# EAGLE design CAN TOF (EAGLE 9.2.2)

## Sheet 1 of 2
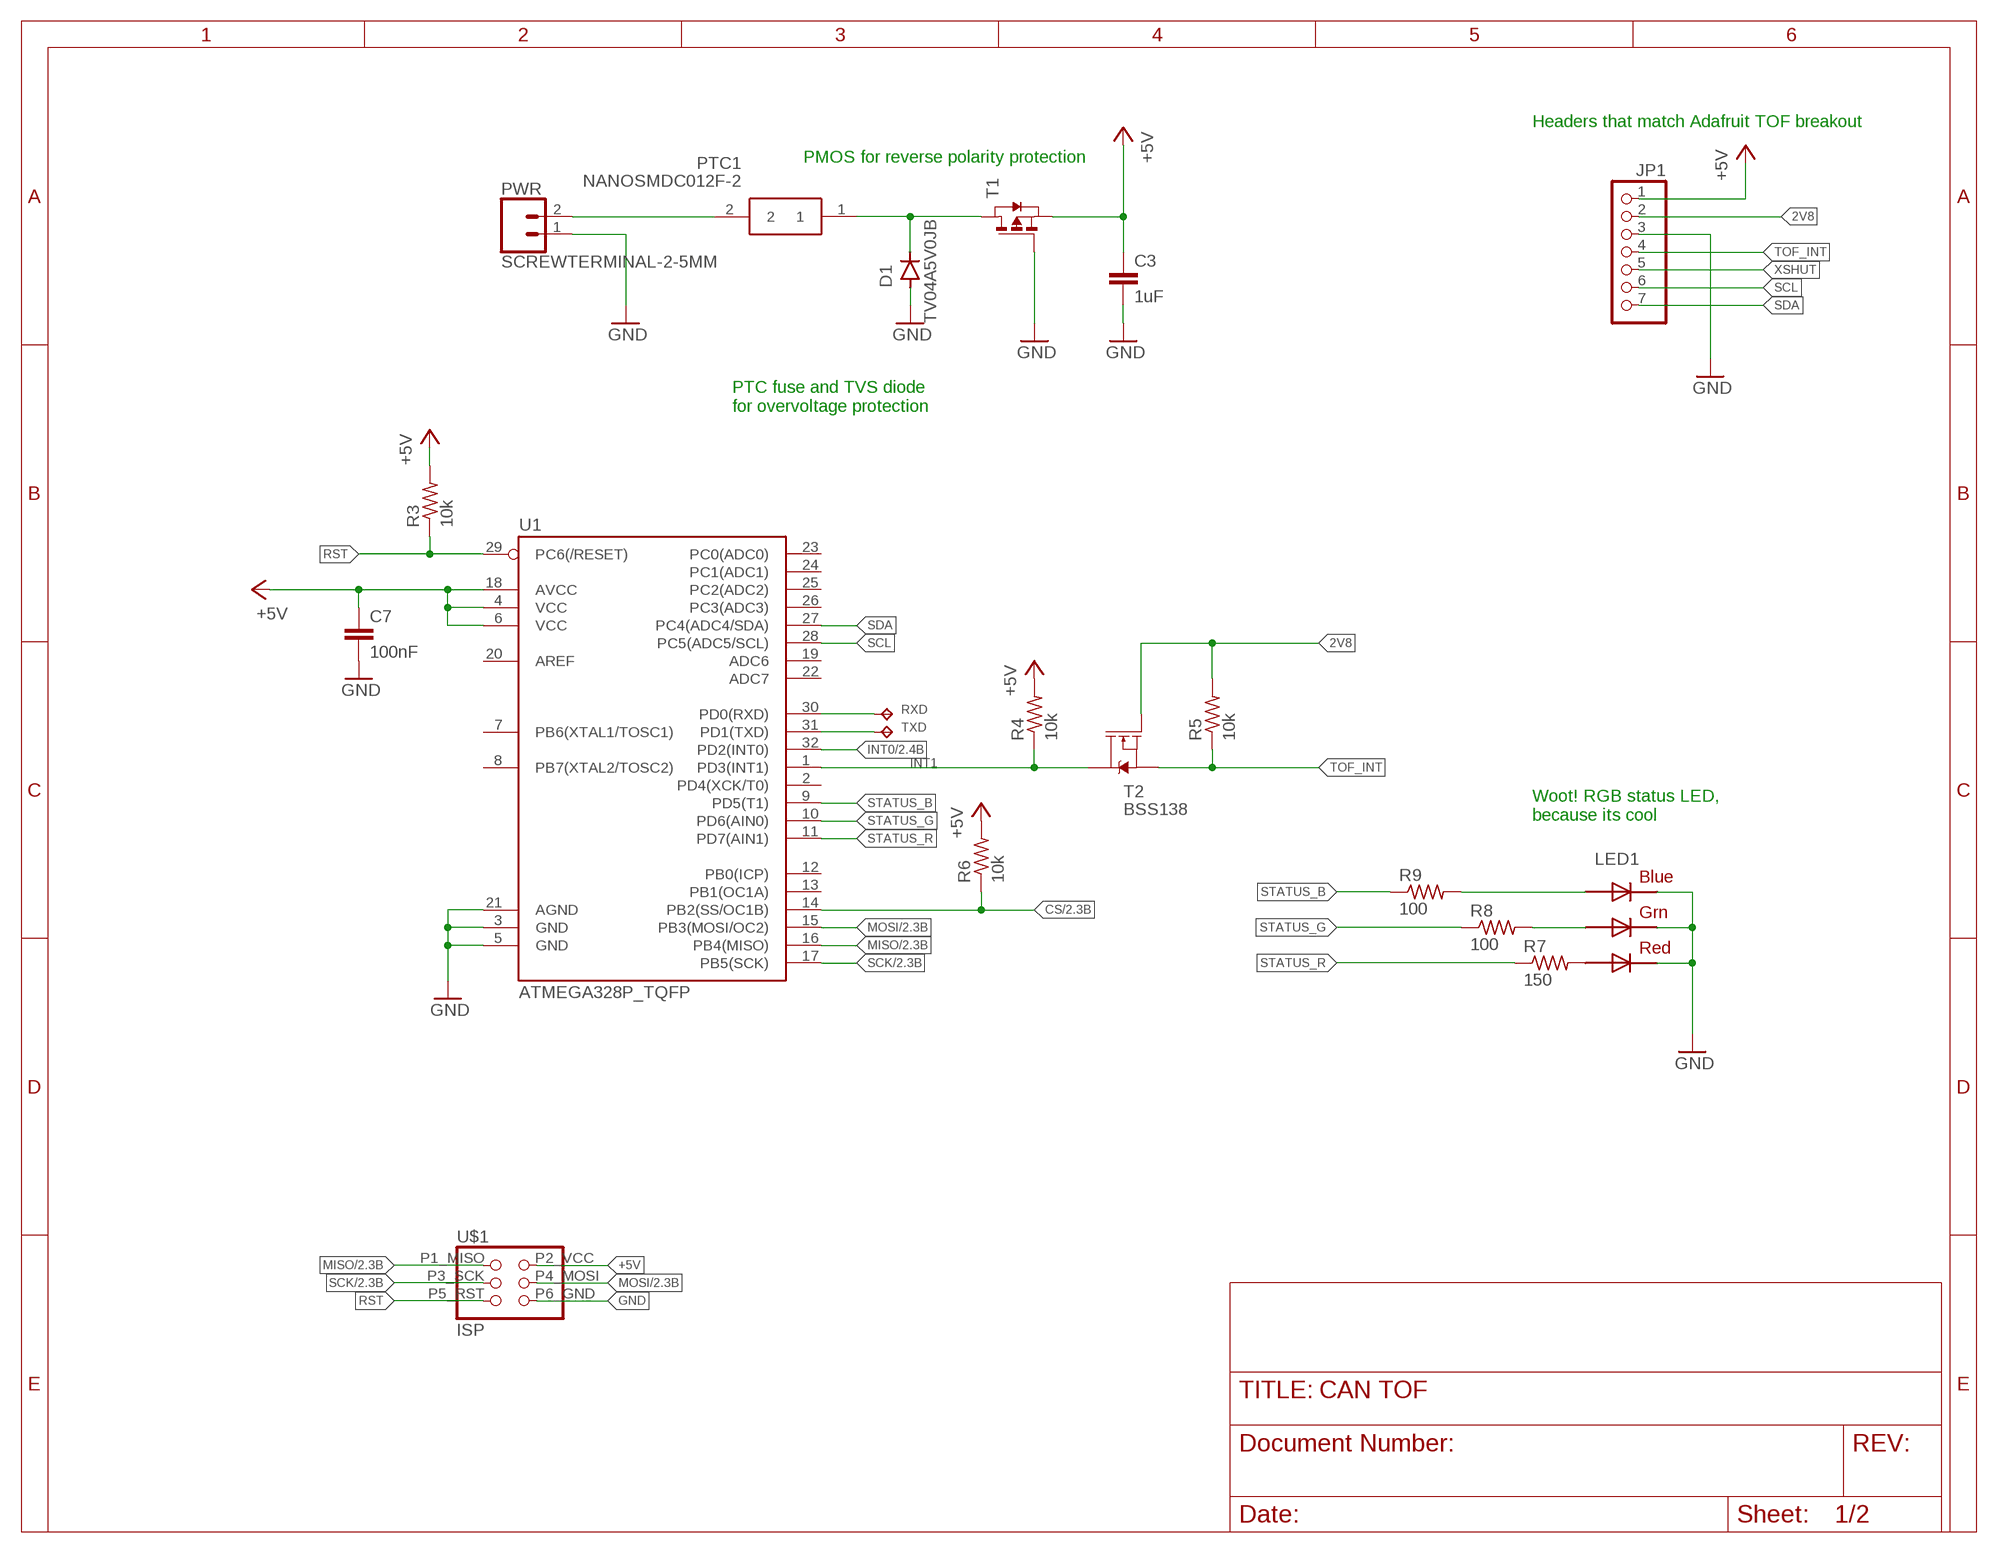
[diagram p0: schematic, sheet 1]

### Parts
C3  1uF  C-EUC0805  [C0805]
C7  100nF  C-EUC0402  [C0402]
D1  TV04A5V0JB  GF1  [SMA-DO214AC]
JP1  PINHD-1X7  [1X07]
LED1  RGBLED5050  [RGBLED5050]
PTC1  NANOSMDC012F-2  NANOSMDC010F-2  [FUSC3216X100N]
PWR  SCREWTERMINAL-2-5MM  [SCREWTERMINAL-5MM-2]
R3  10k  R-US_R0805  [R0805]
R4  10k  R-US_R0805  [R0805]
R5  10k  R-US_R0805  [R0805]
R6  10k  R-US_R0805  [R0805]
R7  150  R-US_R0805  [R0805]
R8  100  R-US_R0805  [R0805]
R9  100  R-US_R0805  [R0805]
RXD  TPB1,27  [B1,27]
T1  PMOSSOT23  [SOT-23]
T2  BSS138  MOSFET-NCH-BSS138  [SOT23-3]
TXD  TPB1,27  [B1,27]
U1  ATMEGA328P_TQFP  [TQFP32-08]
U$1  ISP  [ISP]

### Nets
2V8: JP1.2 R5.2 T2.1(G)
+5V: C3.1 C7.1 JP1.1 R3.2 R4.2 R6.2 T1.2(S) U1.4(VCC) U1.6(VCC) U1.18(AVCC) U$1.P2_VCC(VCC) ; also sheet 2
CS: R6.1 U1.14(PB2(SS/OC1B)) ; also sheet 2
GND: C3.2 C7.2 D1.A JP1.3 LED1.4(BLUE_C) LED1.5(RED_C) LED1.6(GREEN_C) PWR.1 T1.3(G) U1.3(GND) U1.5(GND) U1.21(AGND) U$1.P6_GND(GND) ; also sheet 2
INT0: U1.32(PD2(INT0)) ; also sheet 2
INT1: R4.1 T2.3(D) U1.1(PD3(INT1))
MISO: U1.16(PB4(MISO)) U$1.P1_MISO(MISO) ; also sheet 2
MOSI: U1.15(PB3(MOSI/OC2)) U$1.P4_MOSI(MOSI) ; also sheet 2
N$5: RXD.TP U1.30(PD0(RXD))
N$6: TXD.TP U1.31(PD1(TXD))
N$7: PTC1.2 PWR.2
N$8: D1.K(C) PTC1.1 T1.1(D)
N$9: LED1.2(RED_A) R7.2
N$10: LED1.1(GREEN_A) R8.2
N$11: LED1.3(BLUE_A) R9.2
RST: R3.1 U1.29(PC6(/RESET)) U$1.P5_RST(RST)
SCK: U1.17(PB5(SCK)) U$1.P3_SCK(SCK) ; also sheet 2
SCL: JP1.6 U1.28(PC5(ADC5/SCL))
SDA: JP1.7 U1.27(PC4(ADC4/SDA))
STATUS_B: R9.1 U1.9(PD5(T1))
STATUS_G: R8.1 U1.10(PD6(AIN0))
STATUS_R: R7.1 U1.11(PD7(AIN1))
TOF_INT: JP1.4 R5.1 T2.2(S)
XSHUT: JP1.5
Unconnected: U1.2(PD4(XCK/T0)) U1.7(PB6(XTAL1/TOSC1)) U1.8(PB7(XTAL2/TOSC2)) U1.12(PB0(ICP)) U1.13(PB1(OC1A)) U1.19(ADC6) U1.20(AREF) U1.22(ADC7) U1.23(PC0(ADC0)) U1.24(PC1(ADC1)) U1.25(PC2(ADC2)) U1.26(PC3(ADC3))

### Notes on the sheet
- Headers that match Adafruit TOF breakout
- PMOS for reverse polarity protection
- PTC fuse and TVS diode
  for overvoltage protection
- Woot! RGB status LED,
  because its cool

## Sheet 2 of 2
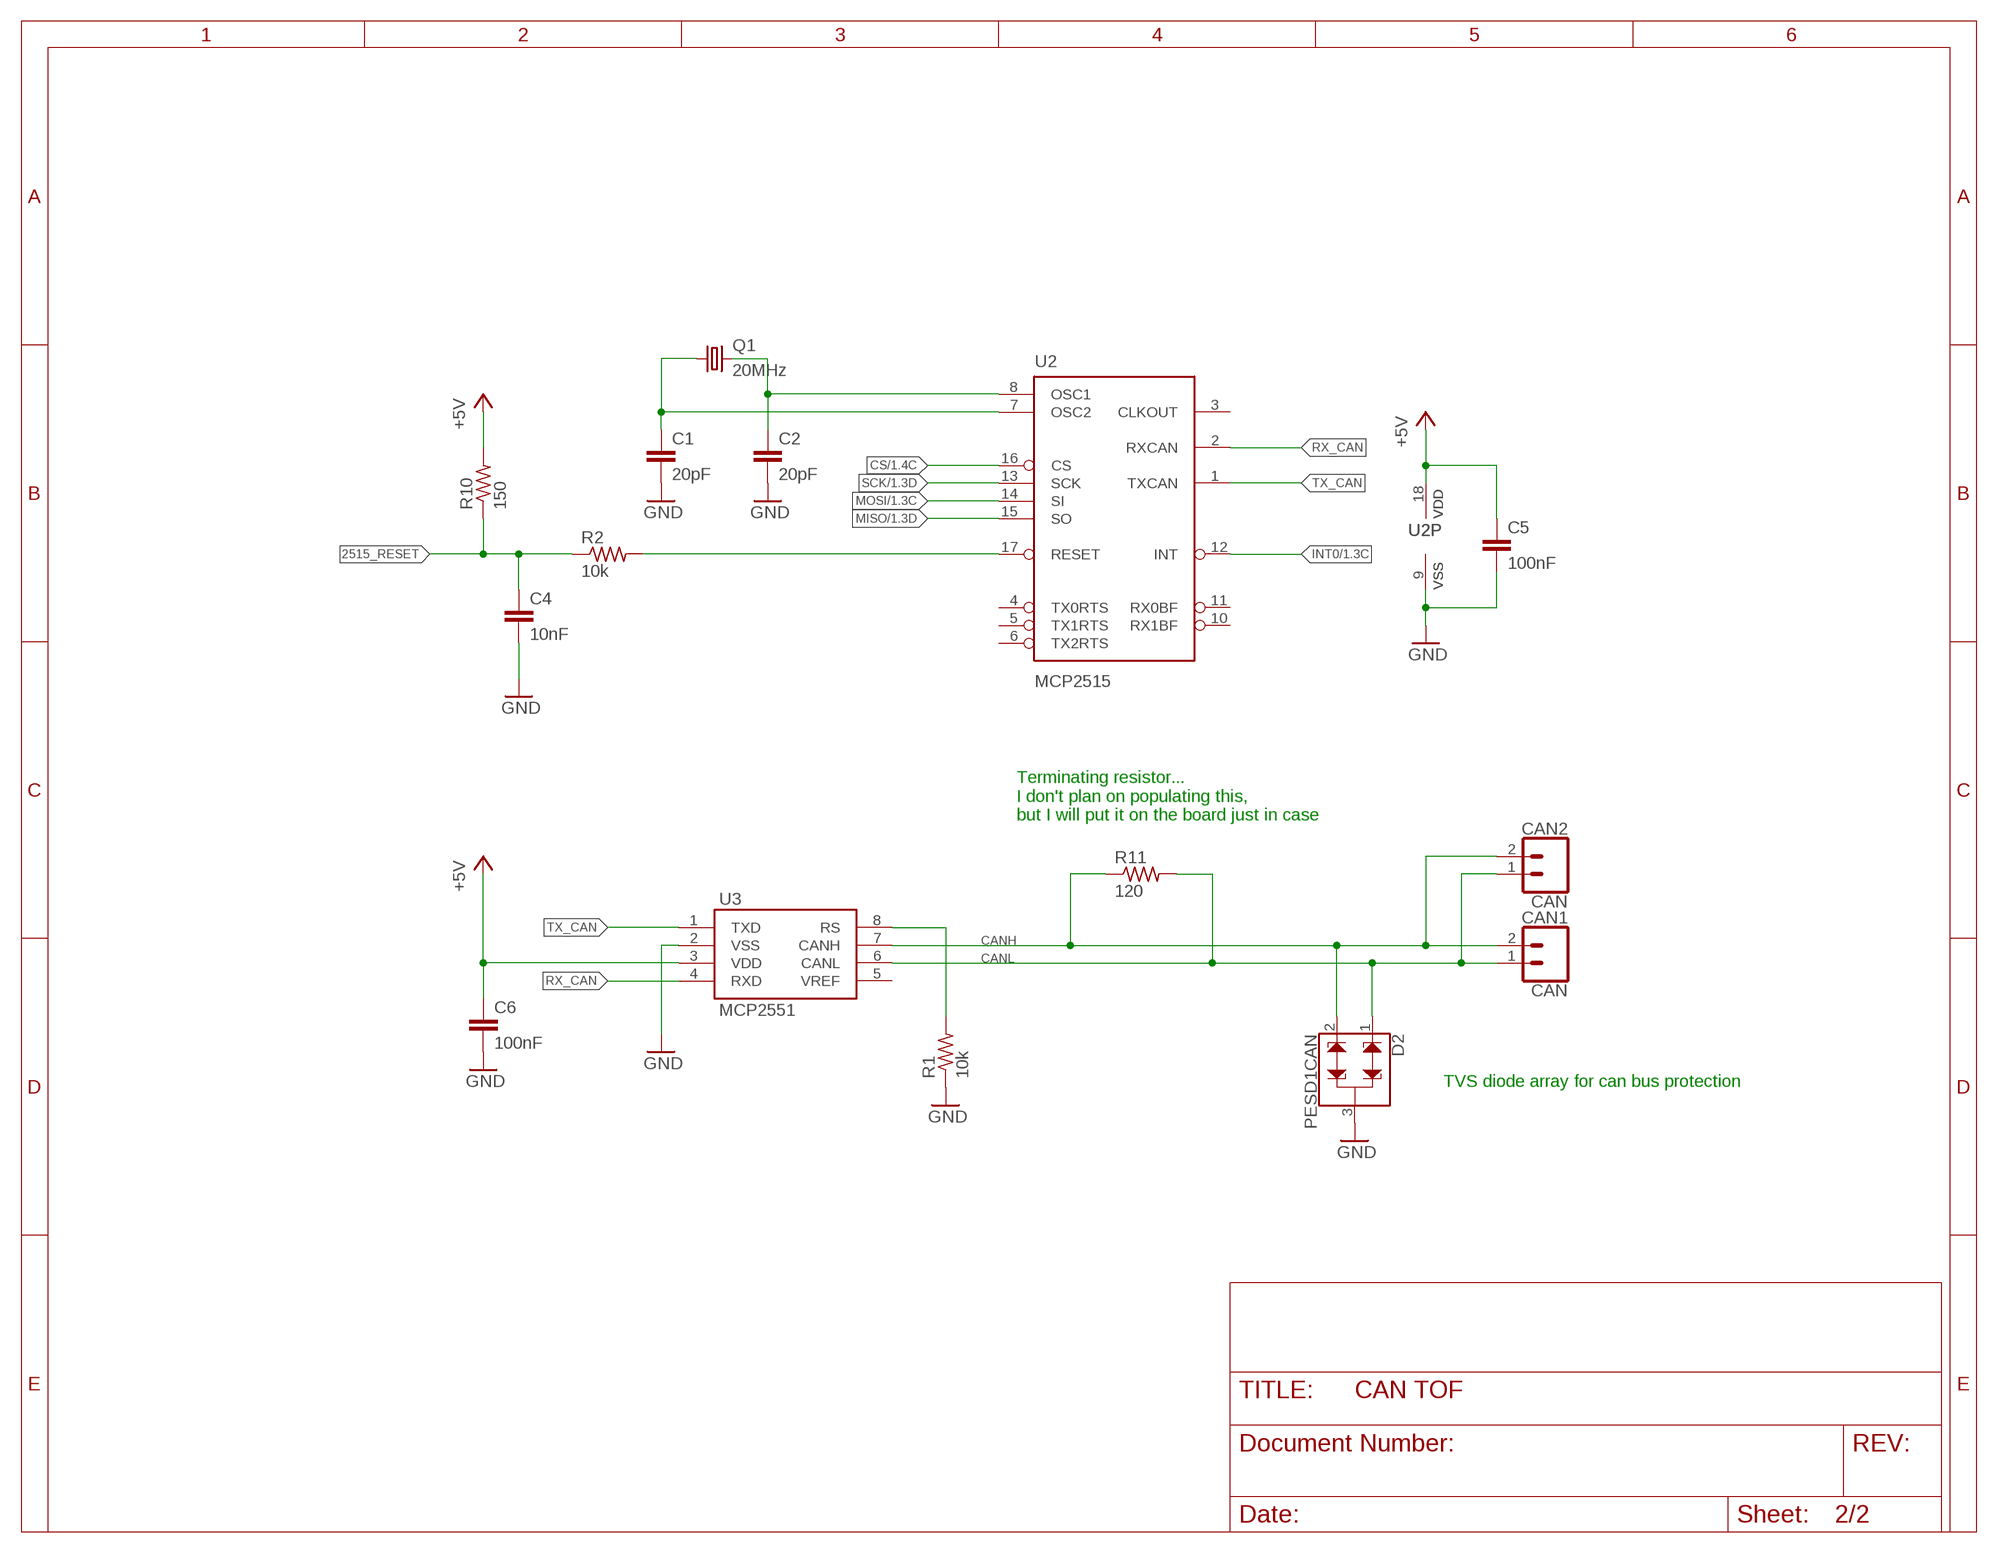
[diagram p1: schematic, sheet 2]

### Parts
C1  20pF  C-EUC0402  [C0402]
C2  20pF  C-EUC0402  [C0402]
C4  10nF  C-EUC0402  [C0402]
C5  100nF  C-EUC0402  [C0402]
C6  100nF  C-EUC0402  [C0402]
CAN1  CAN  SCREWTERMINAL-2-5MM  [SCREWTERMINAL-5MM-2]
CAN2  CAN  SCREWTERMINAL-2-5MM  [SCREWTERMINAL-5MM-2]
D2  PESD1CAN  [SOT23-3]
Q1  20MHz  CRYSTALCTS406  [CTS406]
R1  10k  R-US_R0805  [R0805]
R2  10k  R-US_R0805  [R0805]
R10  150  R-US_R0805  [R0805]
R11  120  R-US_R0805  [R0805]
U2  MCP2515  MCP2515(MCP2510)SO  [SO18W]
U3  MCP2551  [SO08]

### Nets
2515_RESET: C4.1 R2.1 R10.1
+5V: C5.1 C6.1 R10.2 U2.18(VDD) U3.3(VDD) ; also sheet 1
CANH: CAN1.2 CAN2.2 D2.2 R11.1 U3.7(CANH)
CANL: CAN1.1 CAN2.1 D2.1 R11.2 U3.6(CANL)
CS: U2.16(CS) ; also sheet 1
GND: C1.2 C2.2 C4.2 C5.2 C6.2 D2.3 R1.1 U2.9(VSS) U3.2(VSS) ; also sheet 1
INT0: U2.12(INT) ; also sheet 1
MISO: U2.15(SO) ; also sheet 1
MOSI: U2.14(SI) ; also sheet 1
N$1: R1.2 U3.8(RS)
N$2: R2.2 U2.17(RESET)
N$3: C1.1 Q1.1 U2.7(OSC2)
N$4: C2.1 Q1.3 U2.8(OSC1)
RX_CAN: U2.2(RXCAN) U3.4(RXD)
SCK: U2.13(SCK) ; also sheet 1
TX_CAN: U2.1(TXCAN) U3.1(TXD)
Unconnected: U2.3(CLKOUT) U2.4(TX0RTS) U2.5(TX1RTS) U2.6(TX2RTS) U2.10(RX1BF) U2.11(RX0BF) U3.5(VREF)

### Notes on the sheet
- Terminating resistor...
  I don't plan on populating this,
  but I will put it on the board just in case
- TVS diode array for can bus protection

## Library data of the parts
C1-C7 = rcl:C-EU: CAPACITOR, European symbol; SPICEPREFIX: C
CAN1 CAN2 PWR = screw terminals:SCREWTERMINAL-2
D1 = diode:GF1: DIODE
D2 = SparkFun-DiscreteSemi:PESD1CAN: CAN bus ESD protection diode PESD1CAN is used to protect two CAN bus lines from ESD. Link to datasheet <http://www.nxp.com/documents/data_sheet/PESD1CAN-U.pdf> SparkFun Products: SparkFun CAN-BUS Shield <https://www.sparkfun.com/products/13262>; PROD_ID: DIO-12501
JP1 = pinhead:PINHD-1X7: PIN HEADER
LED1 = adafruit:RGBLED: For 5050 RGB LEDs, the order of the LEDs may vary from one manufacturer to another!
PTC1 = SamacSys_Parts:NANOSMDC010F-2: Resettable Fuses - PPTC NANOSMDC010F-2 Source: Datasheet <https://componentsearchengine.com/Datasheets/1/NANOSMDC010F-2.pdf>; DESCRIPTION: Resettable Fuses - PPTC NANOSMDC010F-2; HEIGHT: 1mm; MANUFACTURER_NAME: LITTELFUSE; MANUFACTURER_PART_NUMBER: NANOSMDC010F-2; MOUSER_PART_NUMBER: 650-NANOSMDC010F-2
Q1 = crystal:CRYSTAL: CRYSTAL; OC_FARNELL: unknown; OC_NEWARK: unknown
R1-R11 = rcl:R-US_: RESISTOR, American symbol; SPICEPREFIX: R
RXD TXD = testpad:TP: Test pad
T1 = zetex:PMOSSOT23: MOS FET; OC_FARNELL: unknown; OC_NEWARK: unknown
T2 = SparkFun-DiscreteSemi:MOSFET-NCH: N-channel MOSFETs Voltage controlled devices that allow control of high current outputs. SparkFun Products: SparkFun OpenScale <https://www.sparkfun.com/products/13261> SparkFun Digital Sandbox <https://www.sparkfun.com/products/12651> SparkFun Monster Moto Shield <https://www.sparkfun.com/products/10182> SparkFun MOSFET Power Controller <https://www.sparkfun.com/products/11214>; PROD_ID: TRANS-00830; VALUE: 220mA/50V/3.5Ω
U1 = SparkFun-IC-Microcontroller:ATMEGA328P_TQFP: Popular 328P in QFP Storefront component: ATmega328 - TQFP <https://www.sparkfun.com/products/13448> (COM-13448) Datasheet <http://www.sparkfun.com/datasheets/Components/SMD/ATMega328.pdf> SparkFun Products SparkFun RedBoard - Programmed with Arduino <https://www.sparkfun.com/products/12757> (DEV-12757) Arduino Pro Mini 328 - 5V/16MHz <https://www.sparkfun.com/products/11113> (DEV-11113) Arduino Pro Mini 328 - 3.3V/8MHz <https://www.sparkfun.com/products/11114> (DEV-11114) SparkFun OpenLog <https://www.sparkfun.com/products/13712> (DEV-13712) SparkFun MicroView - OLED Arduino Module <https://www.sparkfun.com/products/12923> (DEV-12923) SparkFun Digital Sandbox <https://www.sparkfun.com/products/12651> (DEV-12651) SparkFun PicoBoard <https://www.sparkfun.com/products/11888> (WIG-11888) Arduino Fio <https://www.sparkfun.com/products/10116> (DEV-10116) LilyPad Arduino 328 Main Board <https://www.sparkfun.com/products/13342> (DEV-13342) SparkFun RedStick <https://www.sparkfun.com/products/13741> (DEV-13741) LilyPad MP3 <https://www.sparkfun.com/products/11013> (DEV-11013) LilyPad Arduino SimpleSnap <https://www.sparkfun.com/products/10941> (DEV-10941) SparkFun Stepoko <https://www.sparkfun.com/products/13899> (ROB-13899) SparkFun Geiger Counter <https://www.sparkfun.com/products/11345> (SEN-11345) SparkFun EL Sequencer <https://www.sparkfun.com/products/12781> (COM-12781) Arduino Pro 328 - 5V/16MHz <https://www.sparkfun.com/products/10915> (DEV-10915) CryptoCape <https://www.sparkfun.com/products/12773> (DEV-12773) SparkFun IR Thermometer Evaluation Board - MLX90614 <https://www.sparkfun.com/products/10740> (SEN-10740) SparkFun RedBot Mainboard <https://www.sparkfun.com/products/12097> (ROB-12097) Arduino Pro 328 - 3.3V/8MHz <https://www.sparkfun.com/products/10914> (DEV-10914) SparkFun Block for Intel® Edison - Arduino <https://www.sparkfun.com/products/13036> (DEV-13036) SparkFun Simon Says - Surface Mount Soldering Kit <https://www.sparkfun.com/products/10935> (KIT-10935) SparkFun 7-Segment Serial Display - Red <https://www.sparkfun.com/products/11441> (COM-11441) SparkFun 7-Segment Serial Display - White <https://www.sparkfun.com/products/11629> (COM-11629) SparkFun 7-Segment Serial Display - Yellow <https://www.sparkfun.com/products/11443> (COM-11443) SparkFun 7-Segment Serial Display - Kelly Green <https://www.sparkfun.com/products/11440> (COM-11440) SparkFun 7-Segment Serial Display - Blue <https://www.sparkfun.com/products/11442> (COM-11442) SparkFun OpenSegment Serial Display - 20mm (Blue) <https://www.sparkfun.com/products/11647> (COM-11647) SparkFun OpenSegment Serial Display - 20mm (Green) <https://www.sparkfun.com/products/11646> (COM-11646) SparkFun OpenSegment Serial Display - 20mm (White) <https://www.sparkfun.com/products/11648> (COM-11648) SparkFun OpenSegment Serial Display - 20mm (Red) <https://www.sparkfun.com/products/11644> (COM-11644) SparkFun OpenSegment Serial Display - 20mm (Yellow) <https://www.sparkfun.com/products/11645> (COM-11645) SparkFun OpenSegment Shield <https://www.sparkfun.com/products/13190> (DEV-13190); PROD_ID: IC-09069
U2 = SparkFun-IC-Comms:MCP2515(MCP2510): CAN controller with SPI interface The MCP2515 controller supercedes the MCP2510 while addressing all errata associated with it. The two devices are pin compatible, either can be used with this device. 18-pin package SOIC Simple SPI interface to any MCU. One-shot mode ensures message transmission is attempted only once Databyte filtering Start-of-Frame (SOF) output Low-power CMOS Technology Datasheet <http://www.sparkfun.com/datasheets/DevTools/Arduino/MCP2515.pdf> SparkFun Products CAN-BUS Shield <https://www.sparkfun.com/products/13262> (DEV-13262); PROD_ID: IC-09906
U3 = SparkFun-IC-Comms:MCP2551: MCP2551 High Speed CAN Transceiver High speed CAN transceiver Datasheet <http://www.sparkfun.com/datasheets/DevTools/Arduino/MCP2551.pdf> SparkFun Products CAN-BUS Shield <https://www.sparkfun.com/products/13262> (DEV-13262) SparkFun OBD-II UART <https://www.sparkfun.com/products/9555> (WIG-09555); PROD_ID: IC-09907
U$1 = test pads&pins:ISP

## Net classes
0 default: width 0.203 mm, drill 0.203 mm

## Board
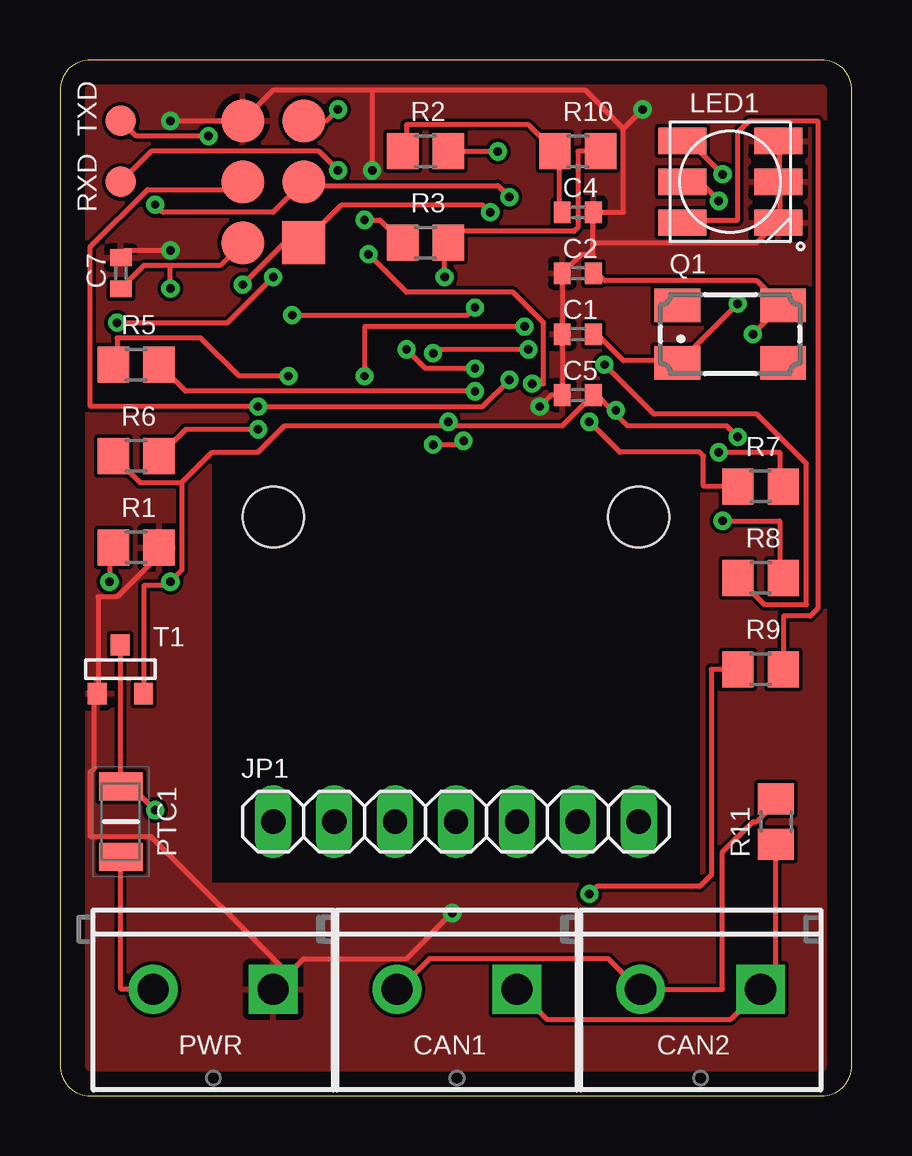
[diagram p2: board, top side]
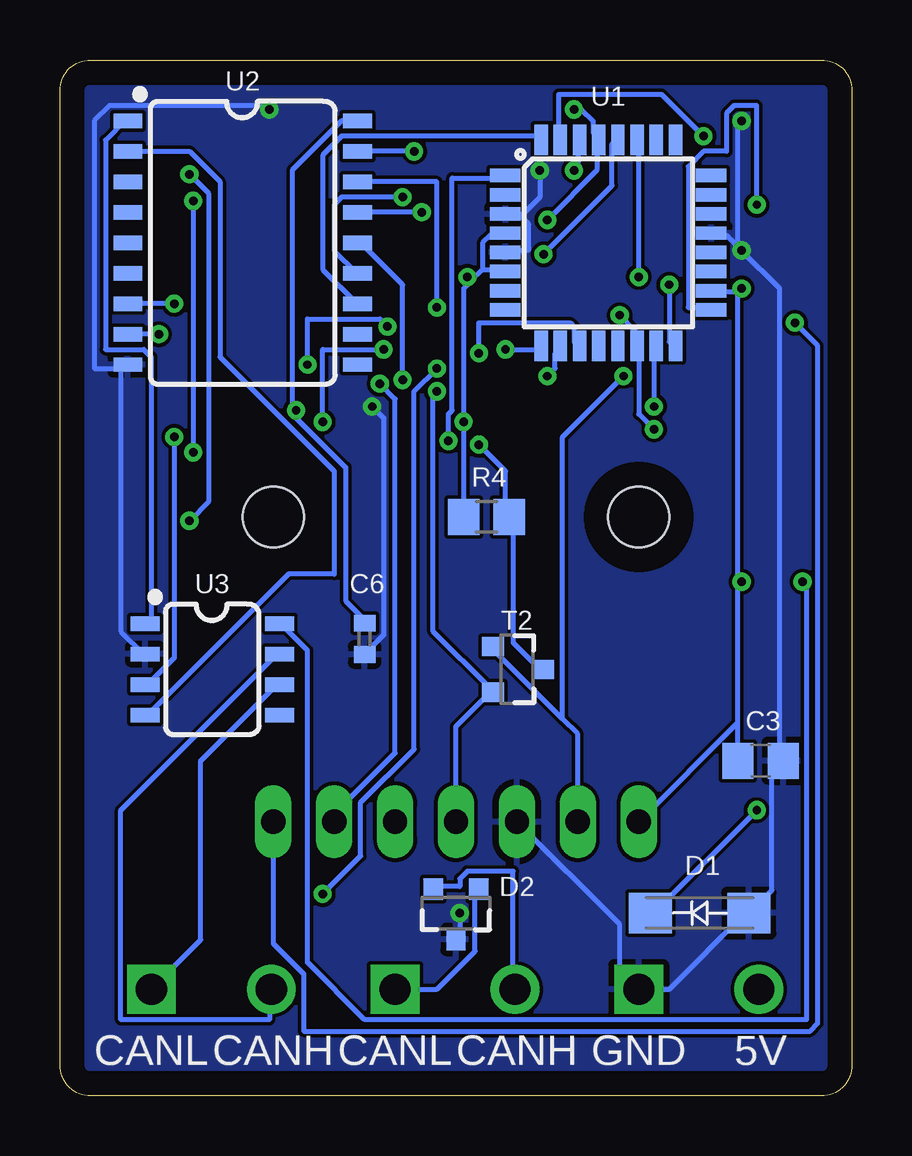
[diagram p3: board, bottom side, seen from below]

Size 33.02 x 43.18 mm. Coordinates in mm from the lower left corner, seen from the top.
Outline: 31.75,43.18 1.27,43.18 arc90 0,41.91 0,1.27 arc90 1.27,0 31.75,0 arc90 33.02,1.27 33.02,41.91 arc90 31.75,43.18
Copper layers (1*16): Top 0.035mm / dielectric 1.5mm / Bottom 0.035mm
Design rules "default *": minimum track width 6mil, minimum drill 0.35mm, track to track 6mil, track to pad 6mil, pad to pad 6mil, via to via 6mil, smd to smd 6mil, copper to edge 40mil, drill to drill 6mil, minimum pad ring 10mil, minimum via ring 8mil, stop-mask expansion 4mil, vias tented up to drill 0.35mm, thermal gap 10mil
Holes 2.54 mm at 8.89,24.13 24.13,24.13
tKeepout: 8 lines
tRestrict: area 6.4,8.9 to 26.7,26.7

### Footprints (pad centres in the part's own frame; a part is rotated, then mirrored left to right if it is on the bottom)
C0402 = smd 0.7 x 0.9: 1 -0.65,0; 2 0.65,0
C0805 = smd 1.3 x 1.5: 1 -0.95,0; 2 0.95,0
SCREWTERMINAL-5MM-2 = drill 1.3 pad 2.032 square: 1 0,0 | drill 1.3 pad 2.032: 2 5,0
SMA-DO214AC = smd 1.8 x 1.7: A -2.05,0; K 2.05,0
SOT23-3 = smd 0.8 x 0.9: 1 -0.95,-1; 2 0.95,-1; 3 0,1.1
1X07 = drill 1.016 long: 1 -7.62,0; 2 -5.08,0; 3 -2.54,0; 4 0,0; 5 2.54,0; 6 5.08,0; 7 7.62,0
RGBLED5050 = smd 2 x 1.1: 1 -2,1.7; 2 -2,0; 3 -2,-1.7; 4 2,-1.7; 5 2,0; 6 2,1.7
FUSC3216X100N = smd 1.16 x 1.81: 1 -1.475,0; 2 1.475,0
CTS406 = smd 1.9 x 1.4: 1 -2.2,-1.2; 2 2.2,-1.2; 3 2.2,1.2; 4 -2.2,1.2
R0805 = smd 1.3 x 1.5: 1 -0.95,0; 2 0.95,0
B1,27 = smd 1.27 x 1.27: TP 0,0
SOT-23 = smd 0.787 x 0.889: 1 0.025,-1.016; 2 -0.94,1.016; 3 0.991,1.016
TQFP32-08 = smd 1.27 x 0.559: 1 -4.293,2.8; 2 -4.293,2; 3 -4.293,1.2; 4 -4.293,0.4; 5 -4.293,-0.4; 6 -4.293,-1.2; 7 -4.293,-2; 8 -4.293,-2.8; 17 4.293,-2.8; 18 4.293,-2; 19 4.293,-1.2; 20 4.293,-0.4; 21 4.293,0.4; 22 4.293,1.2; 23 4.293,2; 24 4.293,2.8 | smd 0.559 x 1.27: 9 -2.8,-4.293; 10 -2,-4.293; 11 -1.2,-4.293; 12 -0.4,-4.293; 13 0.4,-4.293; 14 1.2,-4.293; 15 2,-4.293; 16 2.8,-4.293; 25 2.8,4.293; 26 2,4.293; 27 1.2,4.293; 28 0.4,4.293; 29 -0.4,4.293; 30 -1.2,4.293; 31 -2,4.293; 32 -2.8,4.293
SO18W = smd 0.6 x 1.2: 1 -5.08,-4.788; 2 -3.81,-4.788; 3 -2.54,-4.788; 4 -1.27,-4.788; 5 0,-4.788; 6 1.27,-4.788; 7 2.54,-4.788; 8 3.81,-4.788; 9 5.08,-4.788; 10 5.08,4.788; 11 3.81,4.788; 12 2.54,4.788; 13 1.27,4.788; 14 0,4.788; 15 -1.27,4.788; 16 -2.54,4.788; 17 -3.81,4.788; 18 -5.08,4.788
SO08 = smd 0.6 x 1.2: 1 -1.905,-2.8; 2 -0.635,-2.8; 3 0.635,-2.8; 4 1.905,-2.8; 5 1.905,2.8; 6 0.635,2.8; 7 -0.635,2.8; 8 -1.905,2.8
ISP = smd 1.8 x 1.8: P1_MISO 0,0; P2_VCC 2.54,0; P3_SCK 0,-2.54; P4_MOSI 2.54,-2.54; P5_RST 0,-5.08; P6_GND 2.54,-5.08

### Placement (x,y rotation side)
C1  21.59,31.75 180 top
C2  21.59,34.29 180 top
C3  3.81,13.97 0 bottom
C4  21.59,36.83 0 top
C5  21.59,29.21 180 top
C6  20.32,19.05 270 bottom
C7  2.54,34.29 90 top
CAN1  19.05,4.45 180 top
CAN2  29.21,4.45 180 top
D1  6.35,7.62 180 bottom
D2  16.51,7.62 180 bottom
JP1  16.51,11.43 0 top
LED1  27.94,38.1 0 top
PTC1  2.54,11.43 270 top
PWR  8.89,4.45 180 top
Q1  27.94,31.75 0 top
R1  3.17,22.86 180 top
R2  15.24,39.37 0 top
R3  15.24,35.56 0 top
R4  15.24,24.13 180 bottom
R5  3.17,30.48 180 top
R6  3.17,26.67 180 top
R7  29.21,25.4 0 top
R8  29.21,21.59 0 top
R9  29.21,17.78 0 top
R10  21.59,39.37 0 top
R11  29.84,11.43 270 top
RXD  2.54,38.1 0 top
T1  2.54,17.78 180 top
T2  13.97,17.78 270 bottom
TXD  2.54,40.64 0 top
U1  10.16,35.56 0 bottom
U2  25.4,35.56 270 bottom
U3  26.67,17.78 270 bottom
U$1  10.16,35.56 180 top

### Tracks (layer width: path | path; a pad name or v marks a point on that pad's centre or on a via)
2V8  (via drill 0.35)
  Top 0.203: v9.53,30 7.46,30 5.87,31.59 2.38,31.59 2.38,30.48 R5.2
  Bottom 0.203: 12.06,15.72 11.43,15.08 JP1.2 | 12.06,15.72 14.92,18.57 T2.1 | v9.53,30 12.06,27.46 12.06,15.72
2515_RESET
  Top 0.203: C4.1 20.8,36.83 20.8,39.37 R10.1 19.53,40.48 14.45,40.48 14.45,39.37 R2.1
+5V  (via drill 0.35)
  Top 0.203: 4.6,34.61 6.67,34.61 U$1.P2_VCC | 4.6,34.61 3.49,34.61 2.54,33.66 C7.1 | v4.6,33.66 4.6,34.61 | R10.2 21.59,39.37 21.59,36.2 21.43,36.04 16.67,36.04 R3.2 16.03,35.56 v16.03,34.13 | 5.08,25.56 5.08,21.91 v4.6,21.43 4.45,21.27 3.49,21.27 3.49,16.83 T1.2 | 5.08,25.56 3.33,25.56 R6.2 | 16.19,27.94 9.37,27.94 8.26,26.83 6.35,26.83 5.08,25.56 | 16.19,27.94 20.95,27.94 22.23,29.21 C5.1 22.38,29.21 23.02,28.57 | v28.26,27.46 27.78,27.94 23.65,27.94 23.02,28.57 | 23.02,28.57 v23.18,28.57 | 16.19,27.94 v16.19,28.1
  Bottom 0.203: 4.76,33.5 5.71,33.5 U1.18 | 4.76,15.56 C3.1 | 4.76,15.56 4.76,21.43 | 4.76,21.43 4.76,33.5 | 4.76,15.56 JP1.1 | 4.76,33.5 v4.6,33.66 | 15.4,34.45 14.61,34.45 U1.6 | 15.4,34.45 15.4,35.56 15.08,35.88 14.61,35.88 U1.4 | 15.4,34.45 15.88,33.97 | 15.88,33.97 16.19,33.66 v16.19,28.1 R4.2 | 15.88,33.97 v16.03,34.13 | 23.34,28.57 23.34,38.58 21.27,40.64 U2.18 | 23.34,28.57 23.34,28.42 21.11,26.19 21.11,20.64 20.32,19.84 C6.1 | v28.26,27.46 28.26,18.26 29.37,17.14 U3.3 | v23.18,28.57 23.34,28.57 | v4.6,21.43 4.76,21.43
CANH
  Top 0.203: R11.1 29.84,12.22 29.05,11.43 28.89,11.43 27.62,10.16 27.62,4.45 CAN2.2 24.13,4.45 22.86,5.71 15.4,5.71 14.13,4.45 CAN1.2
  Bottom 0.203: D2.2 17.3,8.73 16.35,8.73 16.35,9.05 16.03,9.37 14.13,9.37 14.13,4.45 CAN1.2 | U3.7 23.97,18.41 30.48,11.91 30.48,3.17 24.29,3.17 24.29,4.45 CAN2.2
CANL
  Top 0.203: R11.2 29.84,4.45 CAN2.1 27.94,3.17 20.32,3.17 CAN1.1
  Bottom 0.203: CAN1.1 17.3,4.45 15.72,6.03 15.72,8.57 D2.1 | CAN2.1 27.15,6.51 27.15,13.97 23.97,17.14 U3.6
CS  (via drill 0.35)
  Top 0.203: v17.3,32.86 16.99,32.54 v9.68,32.54 | v8.26,27.78 5.24,27.78 R6.1
  Bottom 0.203: U2.16 17.3,38.1 v17.3,32.86 | v9.68,32.54 9.05,31.91 9.05,31.27 U1.14 8.89,31.11 8.89,28.42 v8.26,27.78
GND  (via drill 0.35)
  Top 0.203: v20,28.73 20.48,29.21 C5.2 20.95,29.21 20.95,31.75 | 30,38.1 30,36.51 LED1.4 29.84,36.35 29.05,35.56 22.23,35.56 | 30,38.1 30,39.69 LED1.6 | 30,38.1 LED1.5 | 20.95,34.29 20.95,31.75 | 22.23,35.56 22.23,35.08 21.75,35.08 20.95,34.29 | 22.23,35.56 22.23,36.83 C4.2 23.5,36.83 23.5,40.32 | 20.95,34.29 C2.2 | 13.02,41.91 21.91,41.91 23.5,40.32 | 13.02,41.91 8.89,41.91 U$1.P6_GND v4.6,40.64 | 13.02,41.91 v13.02,38.58 | 20.95,31.75 C1.2 | 23.5,40.32 v24.29,41.12 | v4.6,35.24 2.7,35.24 2.54,35.08 C7.2 | R1.1 3.97,22.86 3.97,22.38 2.38,20.8 1.59,20.8 1.59,16.83 T1.3 1.43,16.67 1.43,13.65 1.27,13.49 1.27,10.79 3.81,10.79 9.53,5.08 | v16.35,7.62 14.45,5.71 10.16,5.71 9.53,5.08 | 9.53,5.08 PWR.1
  Bottom 0.203: 30.48,30.32 30.48,19.37 29.53,18.41 U3.2 | 30.48,30.32 30.32,30.48 U2.9 30.48,30.32 | v20,28.73 19.53,28.26 19.53,19.21 20.32,18.41 C6.2 | 13.81,36.67 13.49,36.35 13.49,35.24 14.45,35.24 U1.5 | 13.81,36.67 14.45,36.67 U1.3 | 13.81,36.67 13.02,37.47 v13.02,38.58 | 30.48,30.32 31.59,30.32 31.59,40.64 30.96,41.27 24.29,41.27 v24.29,41.12 | 4.76,35.4 5.24,35.88 5.71,35.88 U1.21 | 3.02,13.97 3.33,13.65 3.33,8.57 4.29,7.62 D1.A 4.45,7.62 7.62,4.45 PWR.1 9.68,5.24 9.68,7.14 JP1.3 | 3.02,13.97 3.02,33.66 v4.6,35.24 4.76,35.4 | 3.02,13.97 C3.2 | v16.35,7.62 16.35,6.83 16.51,6.67 D2.3 | v4.6,40.64 4.76,40.48 4.76,35.4
  pour Bottom: 0,43.18 33.02,43.18 33.02,0 0,0
  pour Top: 33.02,43.18 0,43.18 0,0 33.02,0
INT0
  Bottom 0.203: U2.12 20.64,33.02 22.07,34.45 22.07,39.21 21.27,40.01 13.02,40.01 U1.32
INT1  (via drill 0.35)
  Top 0.203: v16.83,27.3 16.67,27.15 v15.56,27.15
  Bottom 0.203: T2.3 13.02,17.78 14.13,18.89 14.13,23.97 R4.1 14.45,24.13 14.45,26.04 v15.56,27.15 | v16.83,27.3 16.83,28.42 16.67,28.57 16.67,38.26 14.61,38.26 U1.1
MISO  (via drill 0.35)
  Top 0.203: v17.94,36.83 17.62,37.15 11.75,37.15 U$1.P1_MISO 9.37,35.56 v7.62,33.81
  Bottom 0.203: v17.94,36.83 U2.15 | v7.62,33.81 7.62,31.43 7.46,31.27 U1.16
MOSI  (via drill 0.35)
  Top 0.203: v18.73,29.84 17.62,28.73 v8.26,28.73 1.27,28.73 1.27,35.4 3.65,37.78 7.3,37.78 U$1.P4_MOSI
  Bottom 0.203: v18.73,29.84 18.73,33.81 20.48,35.56 U2.14 | v8.26,28.73 8.26,31.11 U1.15
N$1  (via drill 0.35)
  Top 0.203: v2.06,21.43 2.06,22.86 R1.2
  Bottom 0.203: v2.06,21.43 1.91,21.27 1.91,3.17 20.32,3.17 22.7,5.56 22.7,18.57 23.81,19.68 U3.8
N$2  (via drill 0.35)
  Top 0.203: R2.2 v18.26,39.37
  Bottom 0.203: v18.26,39.37 U2.17
N$3  (via drill 0.35)
  Top 0.203: C1.1 22.38,31.75 23.5,30.64 25.72,30.64 Q1.1 25.88,30.64 v28.26,33.02
  Bottom 0.203: v28.26,33.02 U2.7
N$4  (via drill 0.35)
  Top 0.203: C2.1 22.38,34.29 22.7,33.97 29.05,33.97 30,33.02 Q1.3 30,32.86 v28.89,31.75
  Bottom 0.203: v28.89,31.75 U2.8
N$5  (via drill 0.35)
  Top 0.203: RXD.TP 3.81,39.37 10.79,39.37 v11.59,38.58
  Bottom 0.203: v11.59,38.58 11.43,38.73 11.43,39.85 U1.30
N$6  (via drill 0.35)
  Top 0.203: TXD.TP 3.17,40.01 v6.19,40.01
  Bottom 0.203: v6.19,40.01 7.94,41.75 12.22,41.75 12.22,40.01 U1.31
N$7
  Top 0.203: PTC1.2 2.54,4.45 PWR.2
N$8  (via drill 0.35)
  Top 0.203: T1.1 2.54,18.73 PTC1.1 2.54,12.86 3.02,12.86 v3.97,11.91
  Bottom 0.203: v3.97,11.91 8.26,7.62 D1.K
N$9  (via drill 0.35)
  Top 0.203: v27.46,26.83 30,26.83 30,25.4 R7.2 | v27.46,37.31 26.67,38.1 LED1.2
  Bottom 0.203: v27.46,37.31 v27.46,26.83
N$10  (via drill 0.35)
  Top 0.203: v27.62,23.97 30,23.97 30,21.59 R8.2 | v27.62,38.42 26.35,39.69 26.04,39.69 LED1.1
  Bottom 0.203: v27.62,23.97 26.83,24.77 26.83,37.62 v27.62,38.42
N$11
  Top 0.203: R9.2 30.16,20 31.27,20 31.59,20.32 31.59,40.64 28.73,40.64 28.26,40.16 28.26,36.51 26.04,36.51 LED1.3
RST  (via drill 0.35)
  Top 0.203: v11.59,41.12 11.11,40.64 U$1.P5_RST | v12.7,36.51 13.34,36.51 R3.1
  Bottom 0.203: v11.59,41.12 11.27,41.12 10.79,40.64 10.79,40.16 10.64,40.01 U1.29 10.64,39.85 10.64,38.58 v12.7,36.51
RX_CAN
  Bottom 0.203: U2.2 27.62,39.37 26.35,38.1 26.35,30.8 21.59,26.04 21.59,21.75 23.5,21.75 29.37,15.88 U3.4
SCK  (via drill 0.35)
  Top 0.203: v18.73,37.47 18.26,37.94 10.32,37.94 U$1.P3_SCK 8.89,36.83 4.29,36.83 v3.97,37.15
  Bottom 0.203: v18.73,37.47 21.27,37.47 21.59,37.15 21.59,35.24 20.64,34.29 U2.13 | v3.97,37.15 3.97,41.27 4.92,41.27 5.24,40.96 5.24,39.37 6.19,39.37 6.83,38.73 6.83,32.86 5.87,32.86 U1.17
SCL  (via drill 0.35)
  Top 0.203: v12.86,35.08 14.45,33.5 18.89,33.5 20.16,32.23 20.16,29.69 v19.68,29.69
  Bottom 0.203: v12.86,35.08 10,37.94 10,39.69 9.84,39.85 U1.28 | v19.68,29.69 19.05,29.05 19.05,14.29 21.59,11.75 JP1.6
SDA  (via drill 0.35)
  Top 0.203: v8.89,34.13 6.99,32.23 v2.38,32.23
  Bottom 0.203: v8.89,34.13 8.89,39.85 U1.27 | v2.38,32.23 1.43,31.27 1.43,3.02 1.75,2.7 22.86,2.7 22.86,5.08 24.13,6.35 JP1.7
STATUS_B  (via drill 0.35)
  Top 0.203: v14.45,31.11 15.24,30.32 v17.3,30.32 | v22.07,8.41 22.38,8.73 26.67,8.73 27.15,9.21 27.15,17.78 R9.1
  Bottom 0.203: v14.45,31.11 13.02,31.11 U1.9 | v17.3,30.32 18.26,29.37 18.26,14.45 20.48,12.22 20.48,10 v22.07,8.41
STATUS_G  (via drill 0.35)
  Top 0.203: v12.7,30 12.7,32.07 v19.37,32.07 | v22.7,30.48 24.77,28.42 29.05,28.42 31.11,26.35 31.11,20.48 29.37,20.48 R8.1
  Bottom 0.203: v12.7,30 12.38,30.32 12.38,30.96 12.22,31.11 U1.10 | v19.37,32.07 19.68,32.38 22.7,32.38 v22.7,30.48
STATUS_R  (via drill 0.35)
  Top 0.203: v15.56,30.96 15.72,31.11 v19.53,31.11 | v22.07,28.1 23.34,26.83 26.67,26.83 26.83,26.67 26.83,25.4 R7.1
  Bottom 0.203: v15.56,30.96 15.56,32.23 11.75,32.23 11.59,32.07 11.59,31.43 11.43,31.27 U1.11 | v19.53,31.11 22.07,31.11 v22.07,28.1
TOF_INT  (via drill 0.35)
  Top 0.203: v17.3,29.37 5.24,29.37 R5.1
  Bottom 0.203: JP1.4 16.51,15.4 15.08,16.83 T2.2 15.08,16.99 17.46,19.37 17.46,29.21 v17.3,29.37
TX_CAN
  Bottom 0.203: U3.1 29.37,19.68 29.21,19.84 29.21,30.8 29.53,31.11 31.11,31.11 31.11,39.85 30.32,40.64 U2.1

### Text on the board
bNames: 5V | GND | CANH | CANL | CANH | CANL